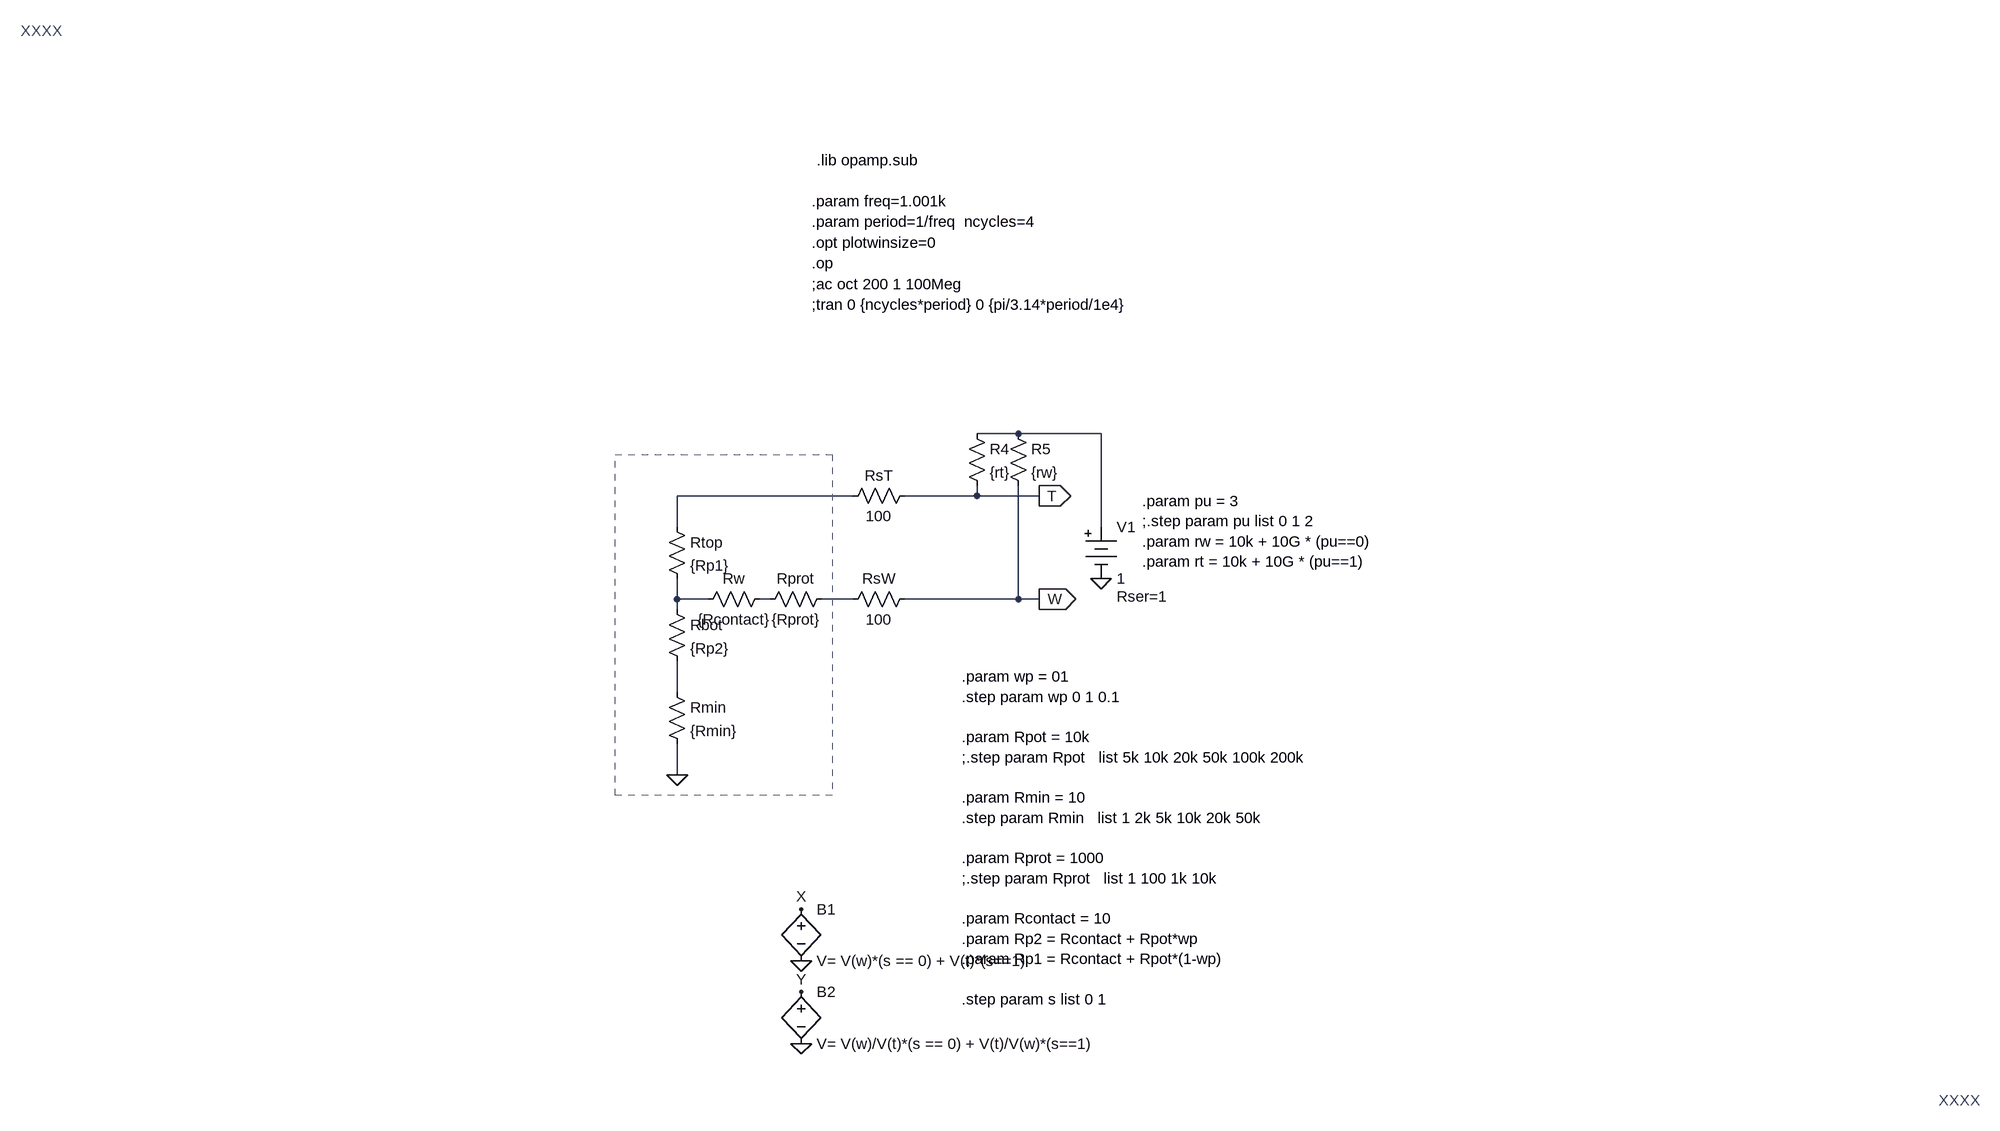
[diagram p0: schematic Standard_and_Offset_Pot.asc]
Standard_and_Offset_Pot.asc, the LTspice schematic file:
Version 4
SHEET 1 2700 1296
WIRE 1200 -208 1136 -208
WIRE 1328 -208 1200 -208
WIRE 944 -112 672 -112
WIRE 1056 -112 1024 -112
WIRE 1136 -112 1136 -128
WIRE 1136 -112 1056 -112
WIRE 1232 -112 1136 -112
WIRE 672 -64 672 -112
WIRE 1328 -64 1328 -208
WIRE 672 48 672 16
WIRE 720 48 672 48
WIRE 816 48 800 48
WIRE 944 48 896 48
WIRE 1056 48 1024 48
WIRE 1200 48 1200 -128
WIRE 1200 48 1056 48
WIRE 1232 48 1200 48
WIRE 672 64 672 48
WIRE 672 192 672 144
WIRE 672 320 672 272
FLAG 672 320 0
FLAG 1328 16 0
FLAG 1232 48 W
IOPIN 1232 48 Out
FLAG 1232 -112 T
IOPIN 1232 -112 Out
FLAG 864 608 0
FLAG 864 528 X
FLAG 864 736 0
FLAG 864 656 Y
DATAFLAG 1056 -112 ""
DATAFLAG 1056 48 ""
SYMBOL Misc\\battery 1328 -80 R0
WINDOW 123 0 0 Left 2
WINDOW 39 24 124 Left 2
SYMATTR SpiceLine Rser=1
SYMATTR InstName V1
SYMATTR Value 1
SYMBOL res 816 32 R90
WINDOW 0 0 56 VBottom 2
WINDOW 3 32 56 VTop 2
SYMATTR InstName Rw
SYMATTR Value {Rcontact}
SYMBOL res 1040 32 R90
WINDOW 0 0 56 VBottom 2
WINDOW 3 32 56 VTop 2
SYMATTR InstName RsW
SYMATTR Value 100
SYMBOL res 1040 -128 R90
WINDOW 0 0 56 VBottom 2
WINDOW 3 32 56 VTop 2
SYMATTR InstName RsT
SYMATTR Value 100
SYMBOL res 1120 -224 R0
SYMATTR InstName R4
SYMATTR Value {rt}
SYMBOL res 1184 -224 R0
SYMATTR InstName R5
SYMATTR Value {rw}
SYMBOL res 656 -80 R0
SYMATTR InstName Rtop
SYMATTR Value {Rp1}
SYMBOL res 656 48 R0
SYMATTR InstName Rbot
SYMATTR Value {Rp2}
SYMBOL res 656 176 R0
SYMATTR InstName Rmin
SYMATTR Value {Rmin}
SYMBOL res 912 32 R90
WINDOW 0 0 56 VBottom 2
WINDOW 3 32 56 VTop 2
SYMATTR InstName Rprot
SYMATTR Value {Rprot}
SYMBOL bv 864 512 R0
SYMATTR InstName B1
SYMATTR Value V= V(w)*(s == 0) + V(t)*(s==1)
SYMBOL bv 864 640 R0
SYMATTR InstName B2
SYMATTR Value V= V(w)/V(t)*(s == 0) + V(t)/V(w)*(s==1)
TEXT 880 -504 Left 2 !.opt plotwinsize=0
TEXT 880 -568 Left 2 !.param freq=1.001k\n.param period=1/freq  ncycles=4
TEXT 880 -472 Left 2 !.op
TEXT 880 -440 Left 2 !;ac oct 200 1 100Meg
TEXT 880 -408 Left 2 !;tran 0 {ncycles*period} 0 {pi/3.14*period/1e4}
TEXT 888 -632 Left 2 !.lib opamp.sub
TEXT 2624 824 Left 2 ;XXXX
TEXT -344 -832 Left 2 ;XXXX
TEXT 1112 168 Left 2 !.param wp = 01\n.step param wp 0 1 0.1\n \n.param Rpot = 10k\n;.step param Rpot   list 5k 10k 20k 50k 100k 200k\n \n.param Rmin = 10\n.step param Rmin   list 1 2k 5k 10k 20k 50k\n \n.param Rprot = 1000\n;.step param Rprot   list 1 100 1k 10k\n \n.param Rcontact = 10\n.param Rp2 = Rcontact + Rpot*wp\n.param Rp1 = Rcontact + Rpot*(1-wp)\n \n.step param s list 0 1
TEXT 1392 -104 Left 2 !.param pu = 3\n;.step param pu list 0 1 2\n.param rw = 10k + 10G * (pu==0)\n.param rt = 10k + 10G * (pu==1)
RECTANGLE Normal 912 352 576 -176 2

The netlist it stands for:
* Standard_and_Offset_Pot.asc
V1 N001 0 1 Rser=1
Rw N004 N003 {Rcontact}
RsW W N005 100
RsT T N002 100
R4 N001 T {rt}
R5 N001 W {rw}
Rtop N002 N003 {Rp1}
Rbot N003 N006 {Rp2}
Rmin N006 0 {Rmin}
Rprot N005 N004 {Rprot}
B1 X 0 V= V(w)*(s == 0) + V(t)*(s==1)
B2 Y 0 V= V(w)/V(t)*(s == 0) + V(t)/V(w)*(s==1)
.opt plotwinsize=0
.param freq=1.001k
.param period=1/freq  ncycles=4
.op
;ac oct 200 1 100Meg
;tran 0 {ncycles*period} 0 {pi/3.14*period/1e4}
.lib opamp.sub
* XXXX
* XXXX
.param wp = 01
.step param wp 0 1 0.1
.param Rpot = 10k
;.step param Rpot   list 5k 10k 20k 50k 100k 200k
.param Rmin = 10
.step param Rmin   list 1 2k 5k 10k 20k 50k
.param Rprot = 1000
;.step param Rprot   list 1 100 1k 10k
.param Rcontact = 10
.param Rp2 = Rcontact + Rpot*wp
.param Rp1 = Rcontact + Rpot*(1-wp)
.step param s list 0 1
.param pu = 3
;.step param pu list 0 1 2
.param rw = 10k + 10G * (pu==0)
.param rt = 10k + 10G * (pu==1)
.backanno
.end